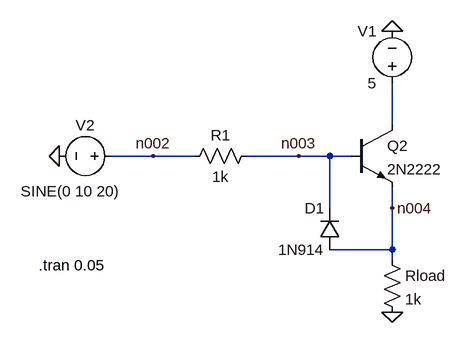
[diagram p0: schematic c02fig19.asc]
c02fig19.asc, the LTspice schematic file:
Version 4
SHEET 1 880 680
WIRE 192 208 192 144
WIRE -176 256 -240 256
WIRE -112 256 -176 256
WIRE 48 256 -32 256
WIRE 96 256 48 256
WIRE 128 256 96 256
WIRE 96 336 96 256
WIRE 192 336 192 304
WIRE 192 400 192 336
WIRE 192 400 96 400
WIRE 192 416 192 400
FLAG 192 496 0
FLAG -320 256 0
FLAG 192 64 0
FLAG -176 256 n002
FLAG 48 256 n003
FLAG 192 336 n004
SYMBOL npn 128 208 R0
SYMATTR InstName Q2
SYMATTR Value 2N2222
SYMBOL res 176 400 R0
SYMATTR InstName Rload
SYMATTR Value 1k
SYMBOL res -16 240 R90
WINDOW 0 0 56 VBottom 2
WINDOW 3 32 56 VTop 2
SYMATTR InstName R1
SYMATTR Value 1k
SYMBOL voltage -224 256 R90
WINDOW 0 -32 56 VBottom 2
WINDOW 3 39 79 VTop 2
WINDOW 123 0 0 Left 0
WINDOW 39 0 0 Left 0
SYMATTR InstName V2
SYMATTR Value SINE(0 10 20)
SYMBOL voltage 192 160 R180
WINDOW 0 24 96 Left 2
WINDOW 3 24 16 Left 2
WINDOW 123 0 0 Left 0
WINDOW 39 0 0 Left 0
SYMATTR InstName V1
SYMATTR Value 5
SYMBOL diode 112 400 R180
WINDOW 0 24 64 Left 2
WINDOW 3 24 0 Left 2
SYMATTR InstName D1
SYMATTR Value 1N914
TEXT -352 424 Left 2 !.tran 0.05

The netlist it stands for:
* c02fig19.asc
Q2 N001 n003 n004 0 2N2222
Rload n004 0 1k
R1 n003 n002 1k
V2 n002 0 SINE(0 10 20)
V1 N001 0 5
D1 n004 n003 1N914
.model D D
.lib standard.dio
.model NPN NPN
.model PNP PNP
.lib standard.bjt
.tran 0.05
.backanno
.end